# Altium schematic sheet I2C_MUX.SchDoc: AMC FMC Carrier v4
size 420 x 297 mm; CmpIndex: 31; Drawing Project: AMC FMC Carrier Board; SymIndex: 2141; CompanyName: WUT; Organization: WUT ISE; Address1: Warsaw Univeristy of Technology; Address2: Nowowiejska 15/19 00-665 Warsaw; Address3: t.przywozki@gmail.com; Revision: 1; SheetNumber: 29; SheetTotal: 29; Project: AMC FMC Carrier v4; ModifiedBy: -; CheckedDate: -; Title2: I2C switches; DivGrp: ISE; Designer: T. Przywozki; ModifiedDate: -; ProjectName: ADC/DAC MEZZANINE
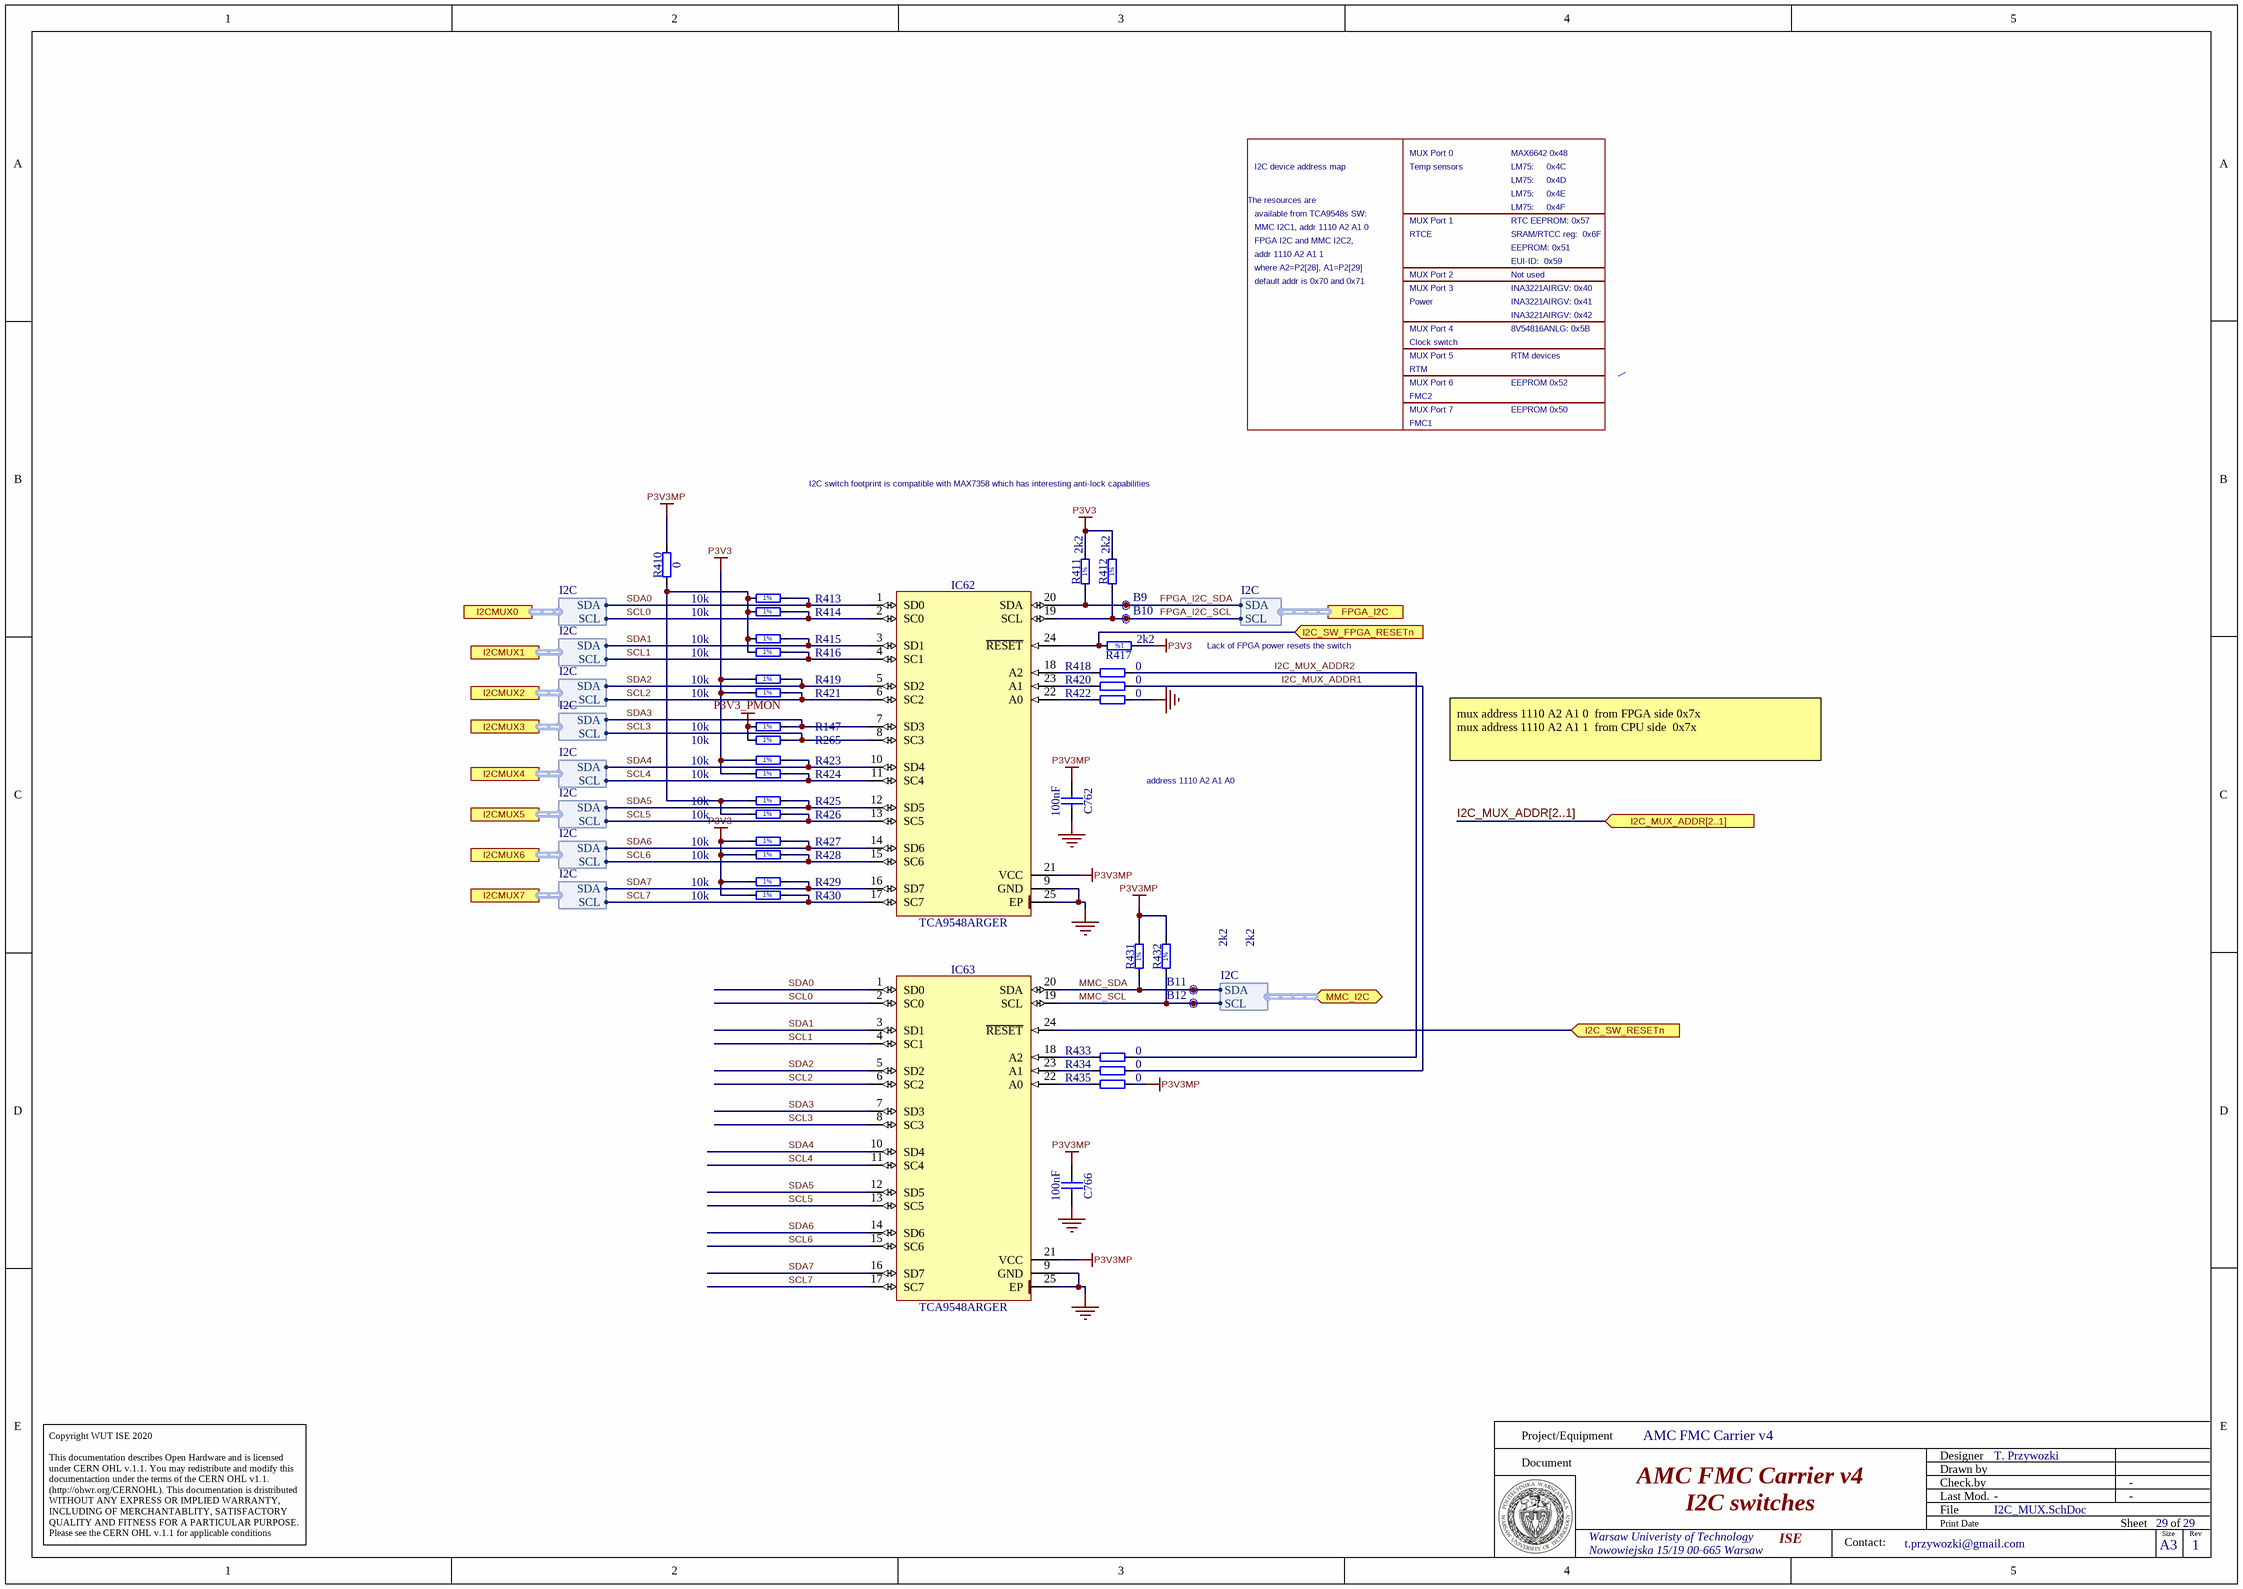
[diagram p0: I2C_MUX.SchDoc]

## Parts
B9  SMD_PAD_D1MM  [C100]  (value not drawn)
B10  SMD_PAD_D1MM  [C100]  (value not drawn)
B11  SMD_PAD_D1MM  [C100]  (value not drawn)
B12  SMD_PAD_D1MM  [C100]  (value not drawn)
C762  100nF  [CAPC0603X33N]
C766  100nF  [CAPC0603X33N]
IC62  TCA9548ARGER  [QFN50P400X400X100-25N-S220]
IC63  TCA9548ARGER  [QFN50P400X400X100-25N-S220]
R147  10k  [RESC1005X40N]
R265  10k  [RESC1005X40N]
R410  0  [RESC1005X40N]
R411  2k2  [RESC1005X40N]
R412  2k2  [RESC1005X40N]
R413  10k  [RESC1005X40N]
R414  10k  [RESC1005X40N]
R415  10k  [RESC1005X40N]
R416  10k  [RESC1005X40N]
R417  2k2  [RESC1005X40N]
R418  0  [RESC1005X40N]
R419  10k  [RESC1005X40N]
R420  0  [RESC1005X40N]
R421  10k  [RESC1005X40N]
R422  0  [RESC1005X40N]
R423  10k  [RESC1005X40N]
R424  10k  [RESC1005X40N]
R425  10k  [RESC1005X40N]
R426  10k  [RESC1005X40N]
R427  10k  [RESC1005X40N]
R428  10k  [RESC1005X40N]
R429  10k  [RESC1005X40N]
R430  10k  [RESC1005X40N]
R431  2k2  [RESC1005X40N]
R432  2k2  [RESC1005X40N]
R433  0  [RESC1005X40N]
R434  0  [RESC1005X40N]
R435  0  [RESC1005X40N]

## Ports
FPGA_I2C (harness I2C), I2C_MUX_ADDR[2..1] (in), I2C_SW_FPGA_RESETn (in), I2C_SW_RESETn (in), I2CMUX0 (harness I2C), I2CMUX1 (harness I2C), I2CMUX2 (harness I2C), I2CMUX3 (harness I2C), I2CMUX4 (harness I2C), I2CMUX5 (harness I2C), I2CMUX6 (harness I2C), I2CMUX7 (harness I2C), MMC_I2C (bidir, harness I2C)

## Harnesses
I2C: SCL, SDA

## Nets
GND: C762.2 C766.2 IC62.9(GND) IC62.25(EP) IC63.9(GND) IC63.25(EP) R422.1
P3V3: R411.2 R412.2 R417.1 R419.1 R421.1 R423.1 R424.1 R427.1 R428.1 R429.1 R430.1
P3V3_PMON: R147.1 R265.1
P3V3MP: C762.1 C766.1 IC62.21(VCC) IC63.21(VCC) R410.1 R431.2 R432.2 R435.1
FPGA_I2C_SCL: B10.1 IC62.19(SCL) R412.1 ; port FPGA_I2C.SCL
FPGA_I2C_SDA: B9.1 IC62.20(SDA) R411.1 ; port FPGA_I2C.SDA
I2C_MUX_ADDR1: R420.1 R434.1
I2C_MUX_ADDR2: R418.1 R433.1
I2C_SW_FPGA_RESETn: IC62.24(~{RESET}) R417.2 ; port I2C_SW_FPGA_RESETn
I2C_SW_RESETn: IC63.24(~{RESET}) ; port I2C_SW_RESETn
MMC_SCL: B12.1 IC63.19(SCL) R432.1 ; port MMC_I2C.SCL
MMC_SDA: B11.1 IC63.20(SDA) R431.1 ; port MMC_I2C.SDA
SCL0: IC62.2(SC0) IC63.2(SC0) R414.2 ; port I2CMUX0.SCL
SCL1: IC62.4(SC1) IC63.4(SC1) R416.2 ; port I2CMUX1.SCL
SCL2: IC62.6(SC2) IC63.6(SC2) R421.2 ; port I2CMUX2.SCL
SCL3: IC62.8(SC3) IC63.8(SC3) R265.2 ; port I2CMUX3.SCL
SCL4: IC62.11(SC4) IC63.11(SC4) R424.2 ; port I2CMUX4.SCL
SCL5: IC62.13(SC5) IC63.13(SC5) R426.2 ; port I2CMUX5.SCL
SCL6: IC62.15(SC6) IC63.15(SC6) R428.2 ; port I2CMUX6.SCL
SCL7: IC62.17(SC7) IC63.17(SC7) R430.2 ; port I2CMUX7.SCL
SDA0: IC62.1(SD0) IC63.1(SD0) R413.2 ; port I2CMUX0.SDA
SDA1: IC62.3(SD1) IC63.3(SD1) R415.2 ; port I2CMUX1.SDA
SDA2: IC62.5(SD2) IC63.5(SD2) R419.2 ; port I2CMUX2.SDA
SDA3: IC62.7(SD3) IC63.7(SD3) R147.2 ; port I2CMUX3.SDA
SDA4: IC62.10(SD4) IC63.10(SD4) R423.2 ; port I2CMUX4.SDA
SDA5: IC62.12(SD5) IC63.12(SD5) R425.2 ; port I2CMUX5.SDA
SDA6: IC62.14(SD6) IC63.14(SD6) R427.2 ; port I2CMUX6.SDA
SDA7: IC62.16(SD7) IC63.16(SD7) R429.2 ; port I2CMUX7.SDA
NetIC62_18: IC62.18(A2) R418.2
NetIC62_22: IC62.22(A0) R422.2
NetIC62_23: IC62.23(A1) R420.2
NetIC63_18: IC63.18(A2) R433.2
NetIC63_22: IC63.22(A0) R435.2
NetIC63_23: IC63.23(A1) R434.2
NetR410_2: R410.2 R413.1 R414.1 R415.1 R416.1 R425.1 R426.1

## Buses and harness runs
bus I2C_MUX_ADDR[2..1] = port I2C_MUX_ADDR[2..1]

## Notes on the sheet
- I2C device address map
- MUX Port 0
- Temp sensors
- MAX6642 0x48
- LM75:     0x4D
- LM75:     0x4C
- The resources are
- FPGA I2C and MMC I2C2,
- available from TCA9548s SW:
- MMC I2C1, addr 1110 A2 A1 0
- addr 1110 A2 A1 1
- MUX Port 1
- RTCE
- LM75:     0x4E
- LM75:     0x4F
- EUI-ID:  0x59
- EEPROM: 0x51
- SRAM/RTCC reg:  0x6F
- RTC EEPROM: 0x57
- where A2=P2[28], A1=P2[29]
- default addr is 0x70 and 0x71
- MUX Port 3
- Power
- MUX Port 2
- INA3221AIRGV: 0x42
- INA3221AIRGV: 0x41
- INA3221AIRGV: 0x40
- Not used
- MUX Port 4
- Clock switch
- MUX Port 5
- RTM
- MUX Port 6
- FMC2
- 8V54816ANLG: 0x5B
- RTM devices
- EEPROM 0x52
- MUX Port 7
- FMC1
- EEPROM 0x50
- I2C switch footprint is compatible with MAX7358 which has interesting anti-lock capabilities
- Lack of FPGA power resets the switch
- address 1110 A2 A1 A0
- mux address 1110 A2 A1 0  from FPGA side 0x7x
  mux address 1110 A2 A1 1  from CPU side  0x7x
- Project/Equipment
- Document
- Designer
- Drawn by
- Check.by
- Copyright WUT ISE 2020
  This documentation describes Open Hardware and is licensed under CERN OHL v.1.1. You may redistribute and modify this documentaction under the terms of the CERN OHL v1.1.
  (http://ohwr.org/CERNOHL). This documentation is dristributed WITHOUT ANY EXPRESS OR IMPLIED WARRANTY, INCLUDING OF MERCHANTABLITY, SATISFACTORY QUALITY AND FITNESS FOR A PARTICULAR PURPOSE. Please see the CERN OHL v.1.1 for applicable conditions
- File
- Last Mod.
- Print Date
- Sheet
- Size
- A3
- of
- Rev
- Contact:
- (in symbol R0402_2K2_1%_0.0625W_100PPM) 1%
- (in symbol R0402_10k_1%_0.0625W_100PPM) 1%

## Library data of the parts
B9 = C100: $$NotCommonProperty_Partition: Pads; Part Description: 1mm Diameter SMD Pad; $$Internal_Resolution: 00001mm; $$NotCommonProperty_Family: SMD Pad; $$NotCommonProperty_Mounted: No; $$NotCommonProperty_Pin Count: 1; $$NotCommonProperty_Sense: No; $$NotCommonProperty_Status: None; CmpIndex: 39; Ref Designator: B12; SymIndex: 2108; $$NotCommonProperty_ComponentHeight: 0mm; $$NotCommonProperty_Footprint Ref: C100; $$NotCommonProperty_SMD: No; $$NotCommonProperty_Socket: No; Cell Name: C100; PackageDescription: 1mm Diameter SMD Pad; Part Name: SMD_PAD_D1MM; Part Number: SMD_PAD_D1MM; Orientation: 0 = 0
B10 = C100: $$NotCommonProperty_Partition: Pads; Part Description: 1mm Diameter SMD Pad; $$Internal_Resolution: 00001mm; $$NotCommonProperty_Family: SMD Pad; $$NotCommonProperty_Mounted: No; $$NotCommonProperty_Pin Count: 1; $$NotCommonProperty_Sense: No; $$NotCommonProperty_Status: None; CmpIndex: 41; Ref Designator: B13; SymIndex: 2108; $$NotCommonProperty_ComponentHeight: 0mm; $$NotCommonProperty_Footprint Ref: C100; $$NotCommonProperty_SMD: No; $$NotCommonProperty_Socket: No; Cell Name: C100; PackageDescription: 1mm Diameter SMD Pad; Part Name: SMD_PAD_D1MM; Part Number: SMD_PAD_D1MM; Orientation: 0 = 0
B11 = C100: $$NotCommonProperty_Partition: Pads; Part Description: 1mm Diameter SMD Pad; $$Internal_Resolution: 00001mm; $$NotCommonProperty_Family: SMD Pad; $$NotCommonProperty_Mounted: No; $$NotCommonProperty_Pin Count: 1; $$NotCommonProperty_Sense: No; $$NotCommonProperty_Status: None; CmpIndex: 44; Ref Designator: B14; SymIndex: 2108; $$NotCommonProperty_ComponentHeight: 0mm; $$NotCommonProperty_Footprint Ref: C100; $$NotCommonProperty_SMD: No; $$NotCommonProperty_Socket: No; Cell Name: C100; PackageDescription: 1mm Diameter SMD Pad; Part Name: SMD_PAD_D1MM; Part Number: SMD_PAD_D1MM; Orientation: 0 = 0
B12 = C100: $$NotCommonProperty_Partition: Pads; Part Description: 1mm Diameter SMD Pad; $$Internal_Resolution: 00001mm; $$NotCommonProperty_Family: SMD Pad; $$NotCommonProperty_Mounted: No; $$NotCommonProperty_Pin Count: 1; $$NotCommonProperty_Sense: No; $$NotCommonProperty_Status: None; CmpIndex: 43; Ref Designator: B15; SymIndex: 2108; $$NotCommonProperty_ComponentHeight: 0mm; $$NotCommonProperty_Footprint Ref: C100; $$NotCommonProperty_SMD: No; $$NotCommonProperty_Socket: No; Cell Name: C100; PackageDescription: 1mm Diameter SMD Pad; Part Name: SMD_PAD_D1MM; Part Number: SMD_PAD_D1MM; Orientation: 0 = 0
C762 C766 = CC0201_100NF_6.3V_10%_X5R: Non-polarised capacitor; Manufacturer: GENERIC; Part Description: SMD Multilayer Chip Ceramic Capacitor; Manufacturer1 Part Number: 02016D104KAT2A; Tolerance: ±10%; Voltage: 6.3V; TC: X5R; Manufacturer Part Number: CC0201_100NF_6.3V_10%_X5R; Part Number: CC0201_100NF_6.3V_10%_X5R; Value: 100nF; Component Kind: Standard; Component Type: Standard; Pin Count: 2; Status: Not Recommended; Case: 0201; Mounted: Yes; Socket: No; SMD: Yes; Sense: No; Manufacturer1 Example: AVX; Manufacturer1 ComponentHeight: 0.33mm; HelpURL: \\cern.ch\dfs\Applications\Altium\Datasheets\CC0201_X5R_AVX.pdf; Author: CERN DEM JLC; CreateDate: 03.12.2007; LatestRevisionDate: 03.12.2007
IC62 IC63 = TCA9548ARGER: Low Voltage 8-Channel I2C Switch With Reset; Manufacturer: TEXAS INSTRUMENTS; PressFit: No; Bonding: No; Manufacturer Part Number: TCA9548ARGER; PackageDescription: QFN, 0.50mm Pitch, Square; 24 Pin, 4.00mm L X 4.00mm W X 1.00mm H body (w/thermal tab 2.2 X 2.2mm), IPC Medium Density; Part Description: Low Voltage 8-Channel I2C Switch With Reset; Part Number: TCA9548ARGER; Component Kind: Standard; Component Type: Standard; Device: TCA9548ARGER; Pin Count: 25; Case: QFN24; Mounted: Yes; Socket: No; SMD: Yes; Sense: No; ComponentHeight: 1mm; Author: CERN DEM JLC; HelpURL: \\cern.ch\dfs\Applications\Altium\Datasheets\TCA9548ARGER.pdf; CreateDate: 07.07.2014; LatestRevisionDate: 07.07.2014
R147 R265 R413-R416 R419 R421 R423-R430 = R0402_10k_1%_0.0625W_100PPM: Resistor - 1%; Manufacturer: GENERIC; Part Description: General Purpose Thick Film Chip Resistor; Manufacturer1 Part Number: 232270671003L; TC: ±100ppm/°C; PressFit: No; Manufacturer Part Number: R0402_10K_1%_0.0625W_100PPM; Part Number: R0402_10K_1%_0.0625W_100PPM; Tolerance: ±1%; Value: 10k; Component Kind: Standard; Component Type: Standard; Pin Count: 2; Status: Not Recommended; Power: 0.0625W; Case: 0402; Mounted: Yes; Sense: No; Socket: No; SMD: Yes; Manufacturer1 Example: YAGEO PHYCOMP; Manufacturer1 ComponentHeight: 0.4mm; HelpURL: \\cern.ch\dfs\Applications\Altium\Datasheets\R0402_Phycomp_RC0402.pdf; Author: CERN DEM JLC; CreateDate: 03.12.2007; LatestRevisionDate: 17.10.2012
R410 R418 R420 R422 R433-R435 = R0402_0R_JUMPER: Resistor; Manufacturer: GENERIC; Part Description: 1A (0.05R Max DC Resistance) Zero Ohm Jumper; Manufacturer1 Part Number: 232270591001L; PressFit: No; Manufacturer Part Number: R0402_0R_JUMPER; Part Number: R0402_0R_JUMPER; Value: 0; Component Kind: Standard; Component Type: Standard; Pin Count: 2; Status: Not Recommended; Case: 0402; Mounted: Yes; Sense: No; Socket: No; SMD: Yes; Manufacturer1 Example: YAGEO PHYCOMP; Manufacturer1 ComponentHeight: 0.4mm; HelpURL: \\cern.ch\dfs\Applications\Altium\Datasheets\R0402_Phycomp_RC0402.pdf; Author: CERN DEM JLC; CreateDate: 03.12.2007; LatestRevisionDate: 17.10.2012
R411 R412 R417 R431 R432 = R0402_2K2_1%_0.0625W_100PPM: Resistor - 1%; Manufacturer: GENERIC; Part Description: General Purpose Thick Film Chip Resistor; Manufacturer1 Part Number: 232270672202L; TC: ±100ppm/°C; PressFit: No; Manufacturer Part Number: R0402_2K2_1%_0.0625W_100PPM; Part Number: R0402_2K2_1%_0.0625W_100PPM; Tolerance: ±1%; Value: 2k2; Component Kind: Standard; Component Type: Standard; Pin Count: 2; Status: Not Recommended; Power: 0.0625W; Case: 0402; Mounted: Yes; Sense: No; Socket: No; SMD: Yes; Manufacturer1 Example: YAGEO PHYCOMP; Manufacturer1 ComponentHeight: 0.4mm; HelpURL: \\cern.ch\dfs\Applications\Altium\Datasheets\R0402_Phycomp_RC0402.pdf; Author: CERN DEM JLC; CreateDate: 03.12.2007; LatestRevisionDate: 17.10.2012